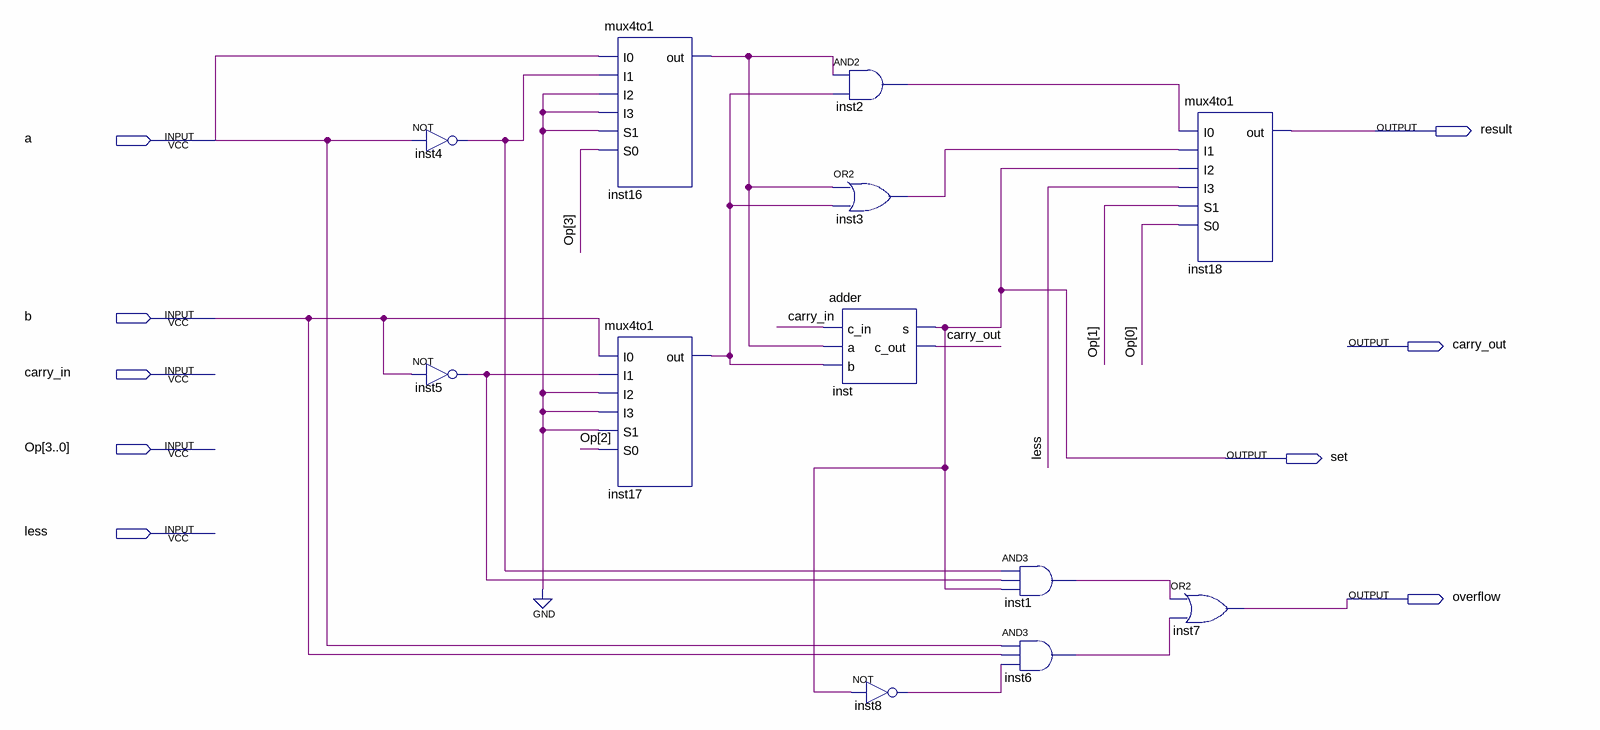
[diagram p0: schematic sheet]
// Quartus schematic MostSignificant.bdf as structural Verilog: 12 symbols, 9 pins
module MostSignificant (
  input  a,
  input  b,
  input  carry_in,
  input  [3:0] Op,
  input  less,
  output result,
  output carry_out,
  output set,
  output overflow
);

  wire inst1_out, inst2_out, inst3_out, inst4_out, inst5_out, inst6_out, inst8_out, inst16_out, inst17_out;

  not inst4 (inst4_out, a);
  not inst5 (inst5_out, b);
  mux4to1 inst16 (.I0(a), .I1(inst4_out), .I2(1'b0), .I3(1'b0), .S1(1'b0), .S0(Op[3]), .out(inst16_out));
  mux4to1 inst17 (.I0(b), .I1(inst5_out), .I2(1'b0), .I3(1'b0), .S1(1'b0), .S0(Op[2]), .out(inst17_out));
  and inst2 (inst2_out, inst16_out, inst17_out);
  or inst3 (inst3_out, inst16_out, inst17_out);
  adder inst (.c_in(carry_in), .a(inst16_out), .b(inst17_out), .s(set), .c_out(carry_out));
  not inst8 (inst8_out, set);
  and inst1 (inst1_out, inst4_out, inst5_out, set);
  and inst6 (inst6_out, a, b, inst8_out);
  or inst7 (overflow, inst1_out, inst6_out);
  mux4to1 inst18 (.I0(inst2_out), .I1(inst3_out), .I2(set), .I3(less), .S1(Op[1]), .S0(Op[0]), .out(result));
endmodule
